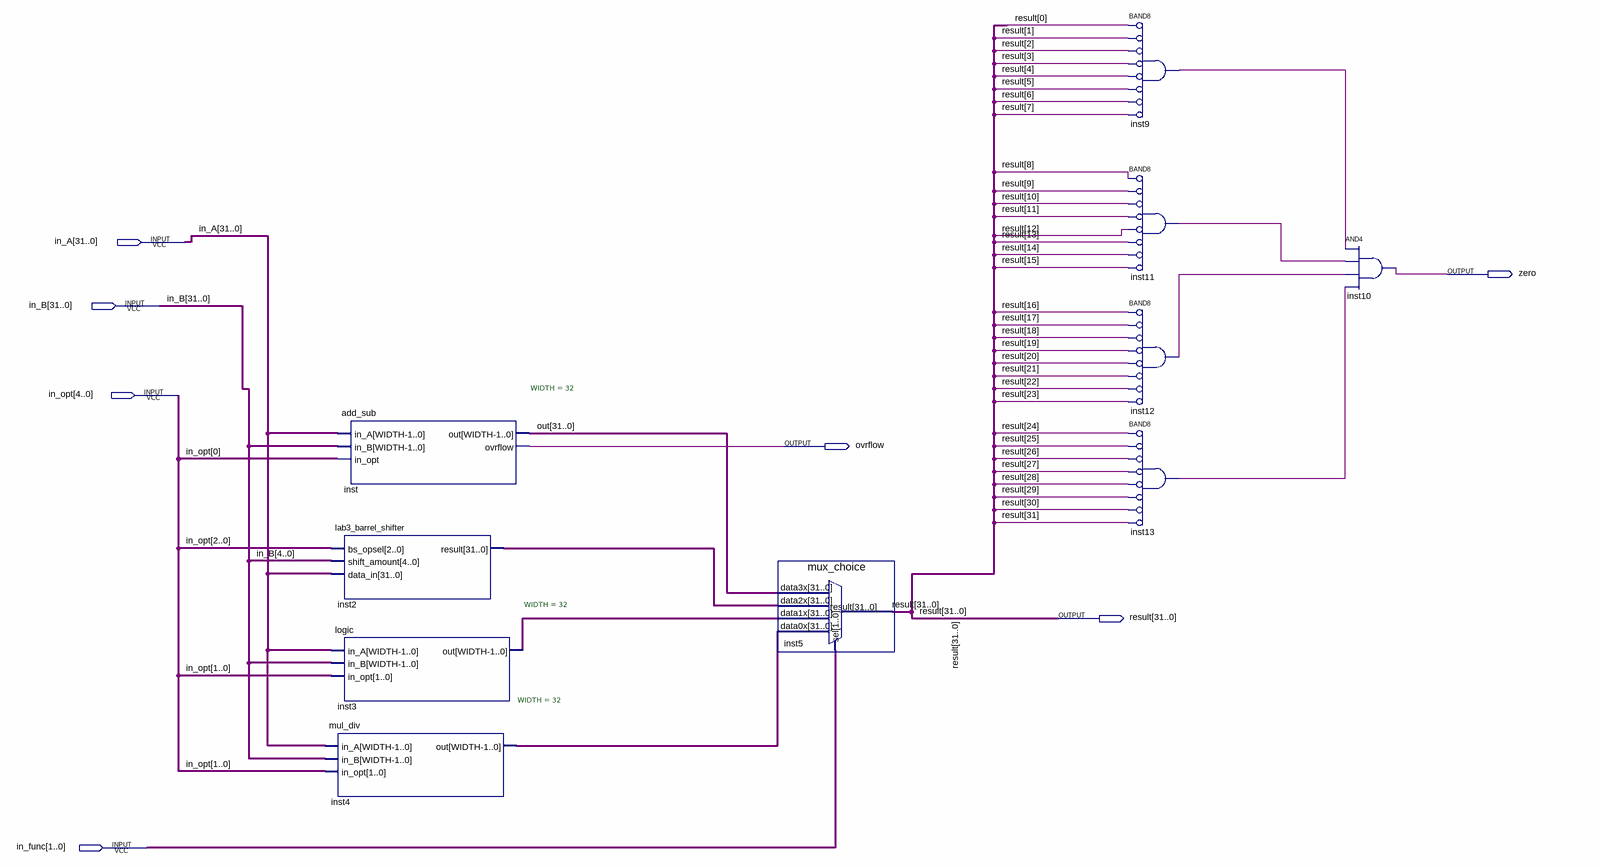
[diagram p0: schematic sheet]
// Quartus schematic Block1.bdf as structural Verilog: 10 symbols, 7 pins
module Block1 (
  input  [31:0] in_A,
  input  [31:0] in_B,
  input  [4:0] in_opt,
  input  [1:0] in_func,
  output zero,
  output ovrflow,
  output [31:0] result
);

  wire inst9_out, inst11_out, inst12_out, inst13_out;
  wire [31:0] inst2_result, inst3_out, inst4_out, out;

  add_sub #(.WIDTH(32)) inst (.in_A(in_A), .in_B(in_B), .in_opt(in_opt[0]), .out(out), .ovrflow(ovrflow));
  lab3_barrel_shifter inst2 (.bs_opsel(in_opt[2:0]), .shift_amount(in_B[4:0]), .data_in(in_A), .result(inst2_result));
  \logic  #(.WIDTH(32)) inst3 (.in_A(in_A), .in_B(in_B), .in_opt(in_opt[1:0]), .out(inst3_out));
  mul_div #(.WIDTH(32)) inst4 (.in_A(in_A), .in_B(in_B), .in_opt(in_opt[1:0]), .out(inst4_out));
  mux_choice inst5 (
    .data3x(out), .data2x(inst2_result), .data1x(inst3_out), .data0x(inst4_out), .sel(in_func),
    .result(result));
  and inst9 (inst9_out, ~result[0], ~result[1], ~result[2], ~result[3], ~result[4], ~result[5], ~result[6], ~result[7]);  // BAND8
  and inst11 (inst11_out, ~result[8], ~result[9], ~result[10], ~result[11], ~result[12], ~result[13], ~result[14], ~result[15]);  // BAND8
  and inst12 (inst12_out, ~result[16], ~result[17], ~result[18], ~result[19], ~result[20], ~result[21], ~result[22], ~result[23]);  // BAND8
  and inst13 (inst13_out, ~result[24], ~result[25], ~result[26], ~result[27], ~result[28], ~result[29], ~result[30], ~result[31]);  // BAND8
  and inst10 (zero, inst9_out, inst11_out, inst12_out, inst13_out);
endmodule
